# EasyEDA Pro project ProPrj_FOC12_2025-04-03.epro, schematic Schematic3
Board Name: SPI编码器板; Create Date: 2025-02-02; Page Name: P1; Project Name: FOC12; Schematic Name: Schematic3; Update Date: 2025-02-02; Company: 嘉立创EDA; Page Size: A4; Version: V1.0
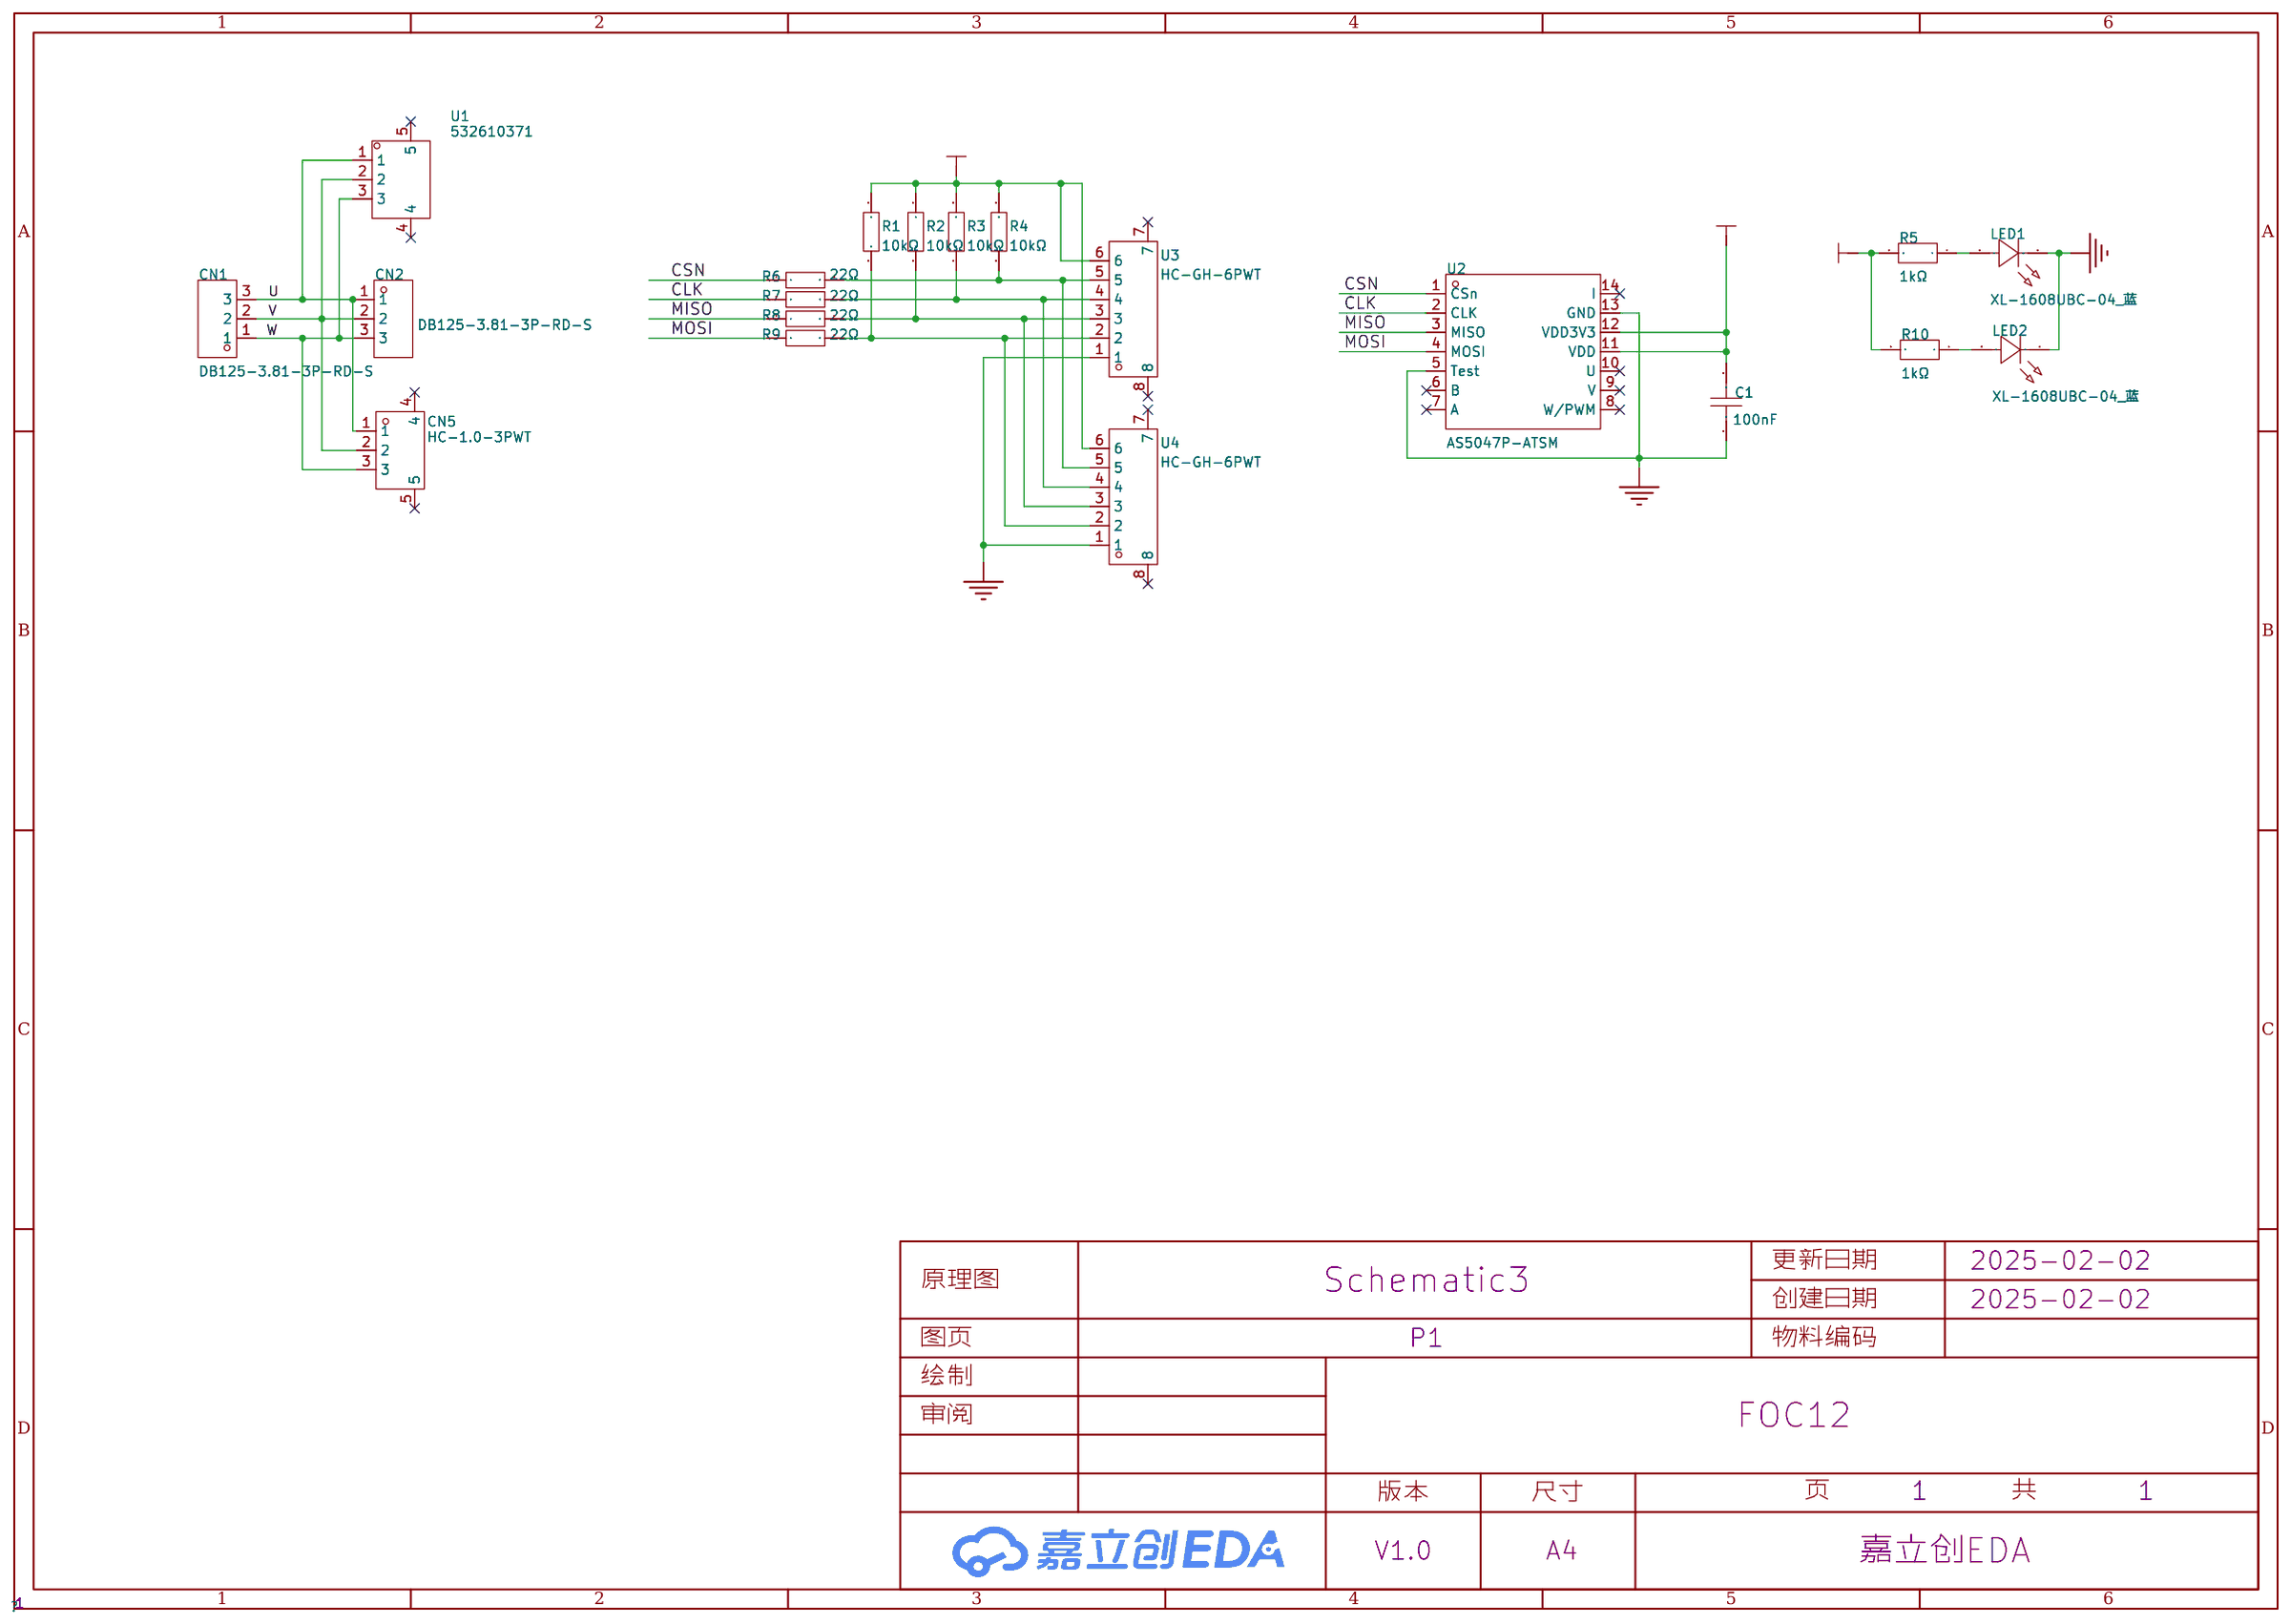
[diagram p2: schematic sheet]

## Parts
C1  100nF  [C0603]
CN1  DB125-3.81-3P-RD-S  [CONN-TH_3P-P3.81_L7.4-W11.4]
CN2  DB125-3.81-3P-RD-S  [CONN-TH_3P-P3.81_L7.4-W11.4]
CN5  HC-1.0-3PWT  [CONN-SMD_3P-P1.0-HC-1.0-3PWT]
LED1  XL-1608UBC-04_蓝  [LED0603-RD_BLUE]
LED2  XL-1608UBC-04_蓝  [LED0603-RD_BLUE]
R1  10kΩ  [R0402]
R2  10kΩ  [R0402]
R3  10kΩ  [R0402]
R4  10kΩ  [R0402]
R5  1kΩ  [R0402]
R6  22Ω  [R0603]
R7  22Ω  [R0603]
R8  22Ω  [R0603]
R9  22Ω  [R0603]
R10  1kΩ  [R0402]
U1  532610371  [CONN-TH_532610371]
U2  AS5047P-ATSM  [TSSOP-14_L5.0-W4.4-P0.65-LS6.4-BL]
U3  HC-GH-6PWT  [CONN-SMD_6P-P1.25_HCTL_HC-GH-6PWT]
U4  HC-GH-6PWT  [CONN-SMD_6P-P1.25_HCTL_HC-GH-6PWT]

## Library data of the parts
C1 = CGA0603X7R104K500JT: 容值:100nF;精度:±10%;额定电压:50V;材质(温度系数):X7R;; LCSC Part Name: 100nF ±10% 50V; Supplier Part: C6119867; Manufacturer: HRE(芯声); Supplier Footprint: 0603; Supplier: LCSC; Tolerance: ±10%; Voltage Rated: 50V; Temperature Coefficient: X7R
CN1 CN2 = DB125-3.81-3P-RD-S: 间距:3.81mm;排数:1;每排PIN数:3;安装方式:直针;额定电流:10A;额定电压:300V;线规 - AWG:16~26;线规 - mm2:0.5~1;工作温度范围:-40℃~+105℃;颜色:红色;; LCSC Part Name: 3.81mm 排数:1 每排P数:3 直针; Supplier Part: C2858301; Manufacturer: DIBO(地博电气); Supplier Footprint: 插件,P=3.81mm; JLCPCB Part Class: Extended Part; Datasheet: https://atta.szlcsc.com/upload/public/pdf/source/20230106/C365471D0EEC4572E65A25F407971D80.pdf; Supplier: LCSC; Pitch: 3.81mm; Number of Rows: 1; Number of PINs Per Row: 3; Mounting Style: 直针; Current Rating (Max): 10A; Voltage Rating (Max): 300V; Wire Gauge - AWG: 16~26; Wire Gauge - mm2: 0.5~1; Operating Temperature Range: -40℃~+105℃; Color: 红色
CN5 = HC-1.0-3PWT: LCSC Part Name: 3P 卧贴 间距P=1mm; Supplier Part: C2845362; Manufacturer: HCTL(华灿天禄); Supplier Footprint: SMD; Datasheet: https://atta.szlcsc.com/upload/public/pdf/source/20210728/C2845362_36DD836A4869B94FBCF024FACE943612.pdf; Supplier: LCSC
LED1 LED2 = XL-1608UBC-04: 发光颜色:蓝色;功率:80mW;正向电流:25mA;主波长:460nm~469nm;透镜颜色:无色透明透镜;色温:-;发光角度:120°;载带方式:正贴;工作温度:-30℃~+85℃;; Supplier Part: C965807; Manufacturer: XINGLIGHT(成兴光); Supplier Footprint: 0603; JLCPCB Part Class: 扩展库; Datasheet: https://atta.szlcsc.com/upload/public/pdf/source/20240218/F76B043D1CDACE9DB8357580572EF0D5.pdf; Supplier: LCSC; Emitted Color: 蓝色; Power Dissipation: 80mW; Forward Current: 25mA; Dominant Wavelength: 460nm~469nm; Peak Wavelength: 475nm; Lens Color: 无色透明透镜; Viewing Angle: 120°; Mounting Sytle: 正贴; Operating Temperature: -30℃~+85℃
R1-R4 = 0402WGF1002TCE: 电阻类型:厚膜电阻;阻值:10kΩ;精度:±1%;功率:62.5mW;温度系数:±100ppm/℃;最大工作电压:50V;工作温度范围:-55℃~+155℃;; LCSC Part Name: 10kΩ ±1% 62.5mW; Supplier Part: C25744; Manufacturer: UNI-ROYAL(厚声); Supplier Footprint: 0402; JLCPCB Part Class: Basic Part; Datasheet: https://atta.szlcsc.com/upload/public/pdf/source/20200306/C422600_1E6D84923E4A46A82E41ADD87F860B5C.pdf; Supplier: LCSC; Type: 厚膜电阻; Tolerance: ±1%; Power(Watts): 62.5mW; Overload Voltage (Max): 50V; Temperature Coefficient: ±100ppm/℃; Operating Temperature Range: -55℃~+155℃
R5 R10 = FRC0402J102 TS: 电阻类型:厚膜电阻;阻值:1kΩ;精度:±5%;功率:62.5mW;最大工作电压:50V;温度系数:±100ppm/℃;; LCSC Part Name: 1kΩ ±5% 62.5mW 厚膜电阻; Supplier Part: C2906899; Manufacturer: FOJAN(富捷); Supplier Footprint: 0402; JLCPCB Part Class: 扩展库; Datasheet: https://atta.szlcsc.com/upload/public/pdf/source/20211221/925EC7D7225764EE0046F22065062C87.pdf; Supplier: LCSC; Type: 厚膜电阻; Tolerance: ±5%; Power(Watts): 62.5mW; Overload Voltage (Max): 50V; Temperature Coefficient: ±100ppm/℃; Operating Temperature Range: -55℃~+155℃
R6-R9 = 0603WAF220JT5E: 电阻类型:厚膜电阻;阻值:22Ω;精度:±1%;功率:100mW;温度系数:±100ppm/℃;最大工作电压:75V;工作温度范围:-55℃~+155℃;; LCSC Part Name: 22Ω ±1% 100mW; Supplier Part: C23345; Manufacturer: UNI-ROYAL(厚声); Supplier Footprint: 0603; JLCPCB Part Class: Basic Part; Datasheet: https://atta.szlcsc.com/upload/public/pdf/source/20200306/C422600_1E6D84923E4A46A82E41ADD87F860B5C.pdf; Supplier: LCSC; Type: 厚膜电阻; Tolerance: ±1%; Power(Watts): 100mW; Overload Voltage (Max): 75V; Temperature Coefficient: ±100ppm/℃; Operating Temperature Range: -55℃~+155℃
U1 = 532610371: 参考系列:-;间距:1.25mm;插针结构:1x3P;排数:1;每排PIN数:3;行距:-;安装方式:-;触头材质:青铜;; Supplier Part: C293630; Manufacturer: MOLEX; Supplier Footprint: SMD,P=1.25mm; JLCPCB Part Class: Extended Part; Datasheet: https://atta.szlcsc.com/upload/public/pdf/source/20181030/C293630_644FD371948C92BD51E6614399C64E30.pdf; Supplier: LCSC; Pins Structure: 1x3P; Pitch: 1.25mm; Number of Rows: 1; Number of PINs Per Row: 3; Contact Material: 青铜
U2 = AS5047P-ATSM_C962063: Supplier Part: C962063; Manufacturer: ams(艾迈斯半导体); Supplier Footprint: TSSOP-14; JLCPCB Part Class: 扩展库; Datasheet: https://atta.szlcsc.com/upload/public/pdf/source/20230424/95EDFD761CCFD379FE860E4B35935AF0.pdf; Supplier: LCSC
U3 U4 = HC-GH-6PWT: 插针结构:1x6P;间距:1.25mm;安装方式:卧贴;参考系列:GH;总PIN数:6P;排数:1;每排PIN数:6;行距:-;额定电流:1A;触头材质:磷青铜;触头镀层:锡;工作温度范围:-25℃~+85℃;; LCSC Part Name: 1x6P 间距:1.25mm 卧贴 系列:GH; Supplier Part: C3011948; Manufacturer: HCTL(华灿天禄); Supplier Footprint: SMD,P=1.25mm,卧贴; JLCPCB Part Class: 扩展库; Datasheet: https://atta.szlcsc.com/upload/public/pdf/source/20210728/C2845397_2BAB5616F3DD52263F1EF5392BF0F2D4.pdf; Supplier: LCSC; Pins Structure: 1x6P; Pitch: 1.25mm; Mounting Style: 卧贴; Reference Series: GH; Number of Pins: 6P; Number of Rows: 1; Number of PINs Per Row: 6; Current Rating (Max): 1A; Contact Material: 磷青铜; Contact Plating: 锡; Operating Temperature Range: -25℃~+85℃; Rated Voltage (Max): 50V; Plastic Material: LCP; Flame Retardant Rating: UL94V-0; Supplementary Features: 辅助焊脚; Z-Height of the Board: 4.25mm; X-Length of Bottom Edge on Board (Spacing Line): 10.75mm

## Nets
+3.3V_1: C1.2 R1.1 R2.1 R3.2 R4.1 R5.2 R10.2 U2.11(VDD) U2.12(VDD3V3) U3.6 U4.6
DGND: C1.1 LED1.1(K) LED2.1(K) U2.5(Test) U2.13(GND) U3.1 U4.1
CLK: R7.1 U2.2(CLK)
CSN: R6.1 U2.1(CSn)
MISO: R8.1 U2.3(MISO)
MOSI: R9.1 U2.4(MOSI)
U: CN1.3 CN2.1 CN5.1 U1.1
V: CN1.2 CN2.2 CN5.2 U1.2
W: CN1.1 CN2.3 CN5.3 U1.3
$1N1242: R2.2 R8.2 U3.3 U4.3
$1N1859: LED1.2(A) R5.1
$1N1862: LED2.2(A) R10.1
$1N3469: R4.2 R6.2 U3.5 U4.5
$1N5453: R3.1 R7.2 U3.4 U4.4
$1N5462: R1.2 R9.2 U3.2 U4.2

Not connected (* = marked no-connect by the designer): CN5 4* 5*; U1 4* 5*; U2 6(B)* 7(A)* 8(W/PWM)* 9(V)* 10(U)* 14(I)*; U3 7* 8*; U4 7* 8*
